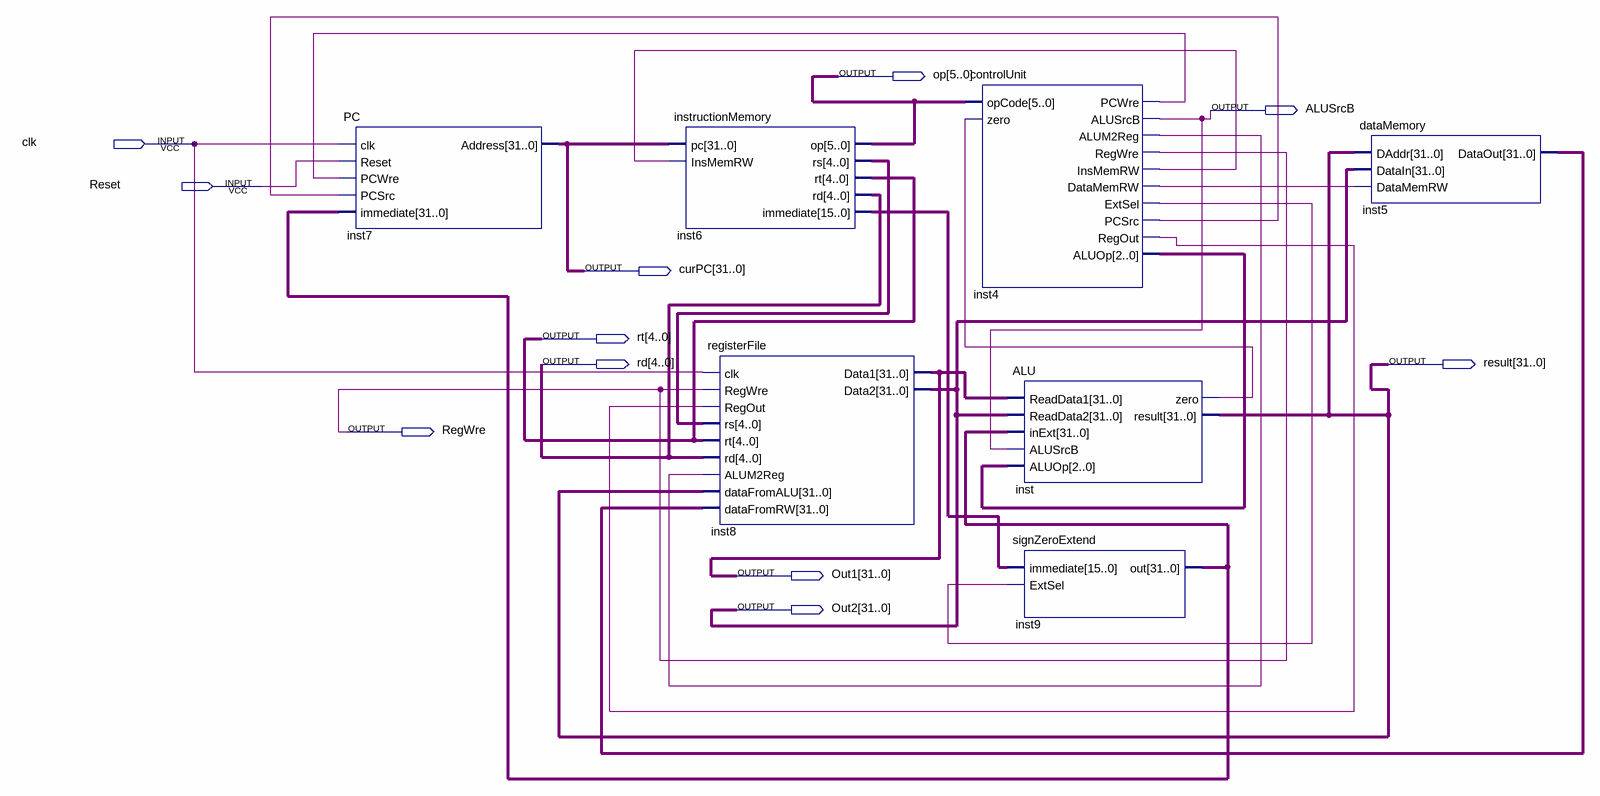
[diagram p0: schematic sheet]
// Quartus schematic CPU.bdf as structural Verilog: 7 symbols, 11 pins
module CPU (
  input  clk,
  input  Reset,
  output [5:0] op,
  output ALUSrcB,
  output [31:0] curPC,
  output [4:0] rt,
  output [4:0] rd,
  output [31:0] result,
  output RegWre,
  output [31:0] Out1,
  output [31:0] Out2
);

  wire inst4_alum2reg, inst4_datamemrw, inst4_extsel, inst4_insmemrw, inst4_pcsrc, inst4_pcwre, inst4_regout,
       inst_zero;
  wire [2:0] inst4_aluop;
  wire [4:0] inst6_rs;
  wire [15:0] inst6_immediate;
  wire [31:0] inst5_dataout, inst9_out;

  PC inst7 (.clk(clk), .Reset(Reset), .PCWre(inst4_pcwre), .PCSrc(inst4_pcsrc), .immediate(inst9_out), .Address(curPC));
  instructionMemory inst6 (
    .pc(curPC), .InsMemRW(inst4_insmemrw), .op(op), .rs(inst6_rs), .rt(rt), .rd(rd),
    .immediate(inst6_immediate));
  registerFile inst8 (
    .clk(clk), .RegWre(RegWre), .RegOut(inst4_regout), .rs(inst6_rs), .rt(rt), .rd(rd),
    .ALUM2Reg(inst4_alum2reg), .dataFromALU(result), .dataFromRW(inst5_dataout), .Data1(Out1), .Data2(Out2));
  controlUnit inst4 (
    .opCode(op), .zero(inst_zero), .PCWre(inst4_pcwre), .ALUSrcB(ALUSrcB), .ALUM2Reg(inst4_alum2reg),
    .RegWre(RegWre), .InsMemRW(inst4_insmemrw), .DataMemRW(inst4_datamemrw), .ExtSel(inst4_extsel),
    .PCSrc(inst4_pcsrc), .RegOut(inst4_regout), .ALUOp(inst4_aluop));
  ALU inst (
    .ReadData1(Out1), .ReadData2(Out2), .inExt(inst9_out), .ALUSrcB(ALUSrcB), .ALUOp(inst4_aluop),
    .zero(inst_zero), .result(result));
  signZeroExtend inst9 (.immediate(inst6_immediate), .ExtSel(inst4_extsel), .out(inst9_out));
  dataMemory inst5 (.DAddr(result), .DataIn(Out2), .DataMemRW(inst4_datamemrw), .DataOut(inst5_dataout));
endmodule
